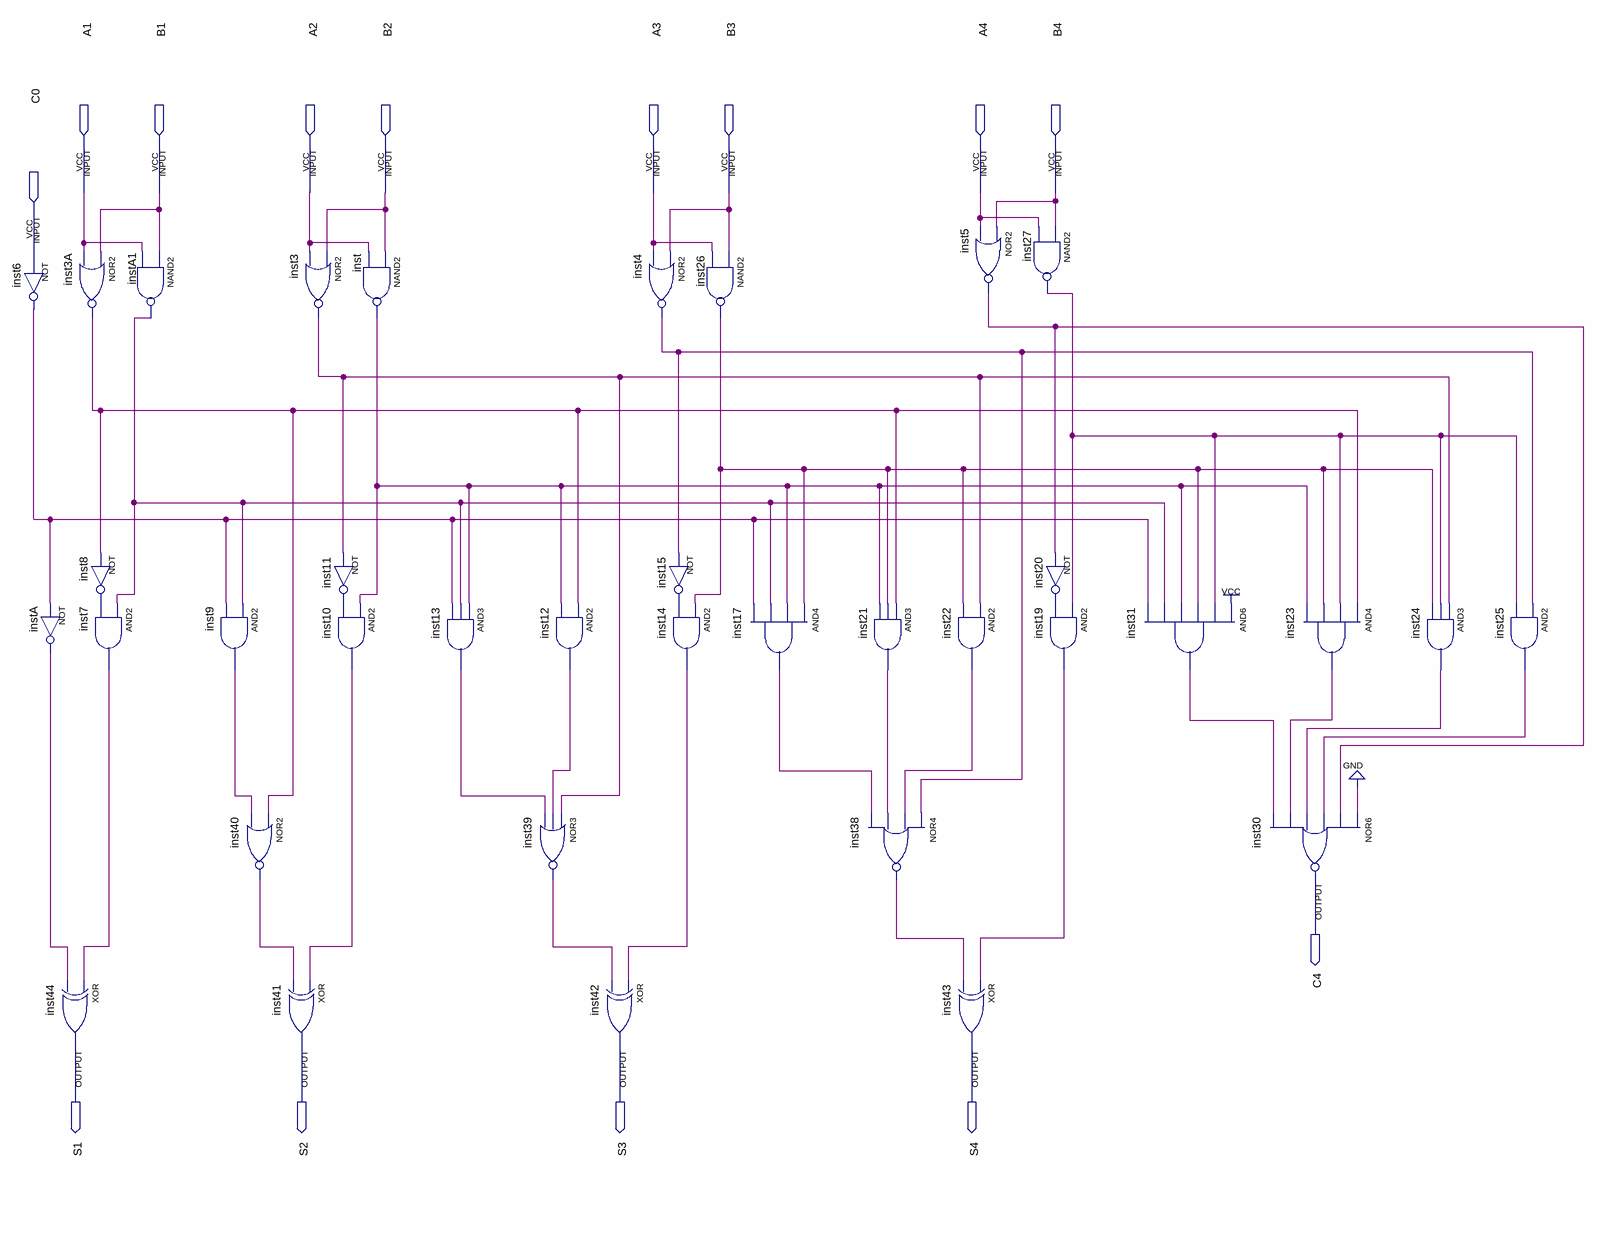
[diagram p0: schematic sheet]
// Quartus schematic ci_74LS283_unidade_aritmetica.bdf as structural Verilog: 36 symbols, 14 pins
module ci_74LS283_unidade_aritmetica (
  input  A1,
  input  B1,
  input  A2,
  input  B2,
  input  A3,
  input  B3,
  input  A4,
  input  B4,
  input  C0,
  output C4,
  output S1,
  output S2,
  output S3,
  output S4
);

  wire inst3_out, inst3A_out, inst4_out, inst5_out, inst6_out, inst7_out, inst8_out, inst9_out, inst10_out,
       inst11_out, inst12_out, inst13_out, inst14_out, inst15_out, inst17_out, inst19_out, inst20_out,
       inst21_out, inst22_out, inst23_out, inst24_out, inst25_out, inst26_out, inst27_out, inst31_out,
       inst38_out, inst39_out, inst40_out, inst_out, instA1_out, instA_out;

  nor inst3A (inst3A_out, B1, A1);
  not inst6 (inst6_out, C0);
  not instA (instA_out, inst6_out);
  xor inst44 (S1, inst7_out, instA_out);
  nand instA1 (instA1_out, B1, A1);
  not inst8 (inst8_out, inst3A_out);
  and inst7 (inst7_out, instA1_out, inst8_out);
  and inst9 (inst9_out, instA1_out, inst6_out);
  nor inst40 (inst40_out, inst3A_out, inst9_out);
  xor inst41 (S2, inst10_out, inst40_out);
  nor inst3 (inst3_out, B2, A2);
  not inst11 (inst11_out, inst3_out);
  and inst10 (inst10_out, inst_out, inst11_out);
  nand inst (inst_out, B2, A2);
  and inst13 (inst13_out, inst_out, instA1_out, inst6_out);
  and inst12 (inst12_out, inst3A_out, inst_out);
  nor inst39 (inst39_out, inst3_out, inst12_out, inst13_out);
  xor inst42 (S3, inst14_out, inst39_out);
  nor inst4 (inst4_out, B3, A3);
  not inst15 (inst15_out, inst4_out);
  and inst14 (inst14_out, inst26_out, inst15_out);
  nand inst26 (inst26_out, B3, A3);
  and inst17 (inst17_out, inst26_out, inst_out, instA1_out, inst6_out);
  and inst21 (inst21_out, inst3A_out, inst26_out, inst_out);
  nor inst38 (inst38_out, inst4_out, inst22_out, inst21_out, inst17_out);
  and inst22 (inst22_out, inst3_out, inst26_out);
  xor inst43 (S4, inst19_out, inst38_out);
  nor inst5 (inst5_out, B4, A4);
  nand inst27 (inst27_out, B4, A4);
  not inst20 (inst20_out, inst5_out);
  and inst19 (inst19_out, inst27_out, inst20_out);
  and inst31 (inst31_out, 1'b1, inst27_out, inst26_out, inst_out, instA1_out, inst6_out);
  nor inst30 (C4, 1'b0, inst5_out, inst25_out, inst24_out, inst23_out, inst31_out);
  and inst23 (inst23_out, inst3A_out, inst27_out, inst26_out, inst_out);
  and inst24 (inst24_out, inst3_out, inst27_out, inst26_out);
  and inst25 (inst25_out, inst4_out, inst27_out);
endmodule
